# EAGLE design X-Light (EAGLE 6.4)
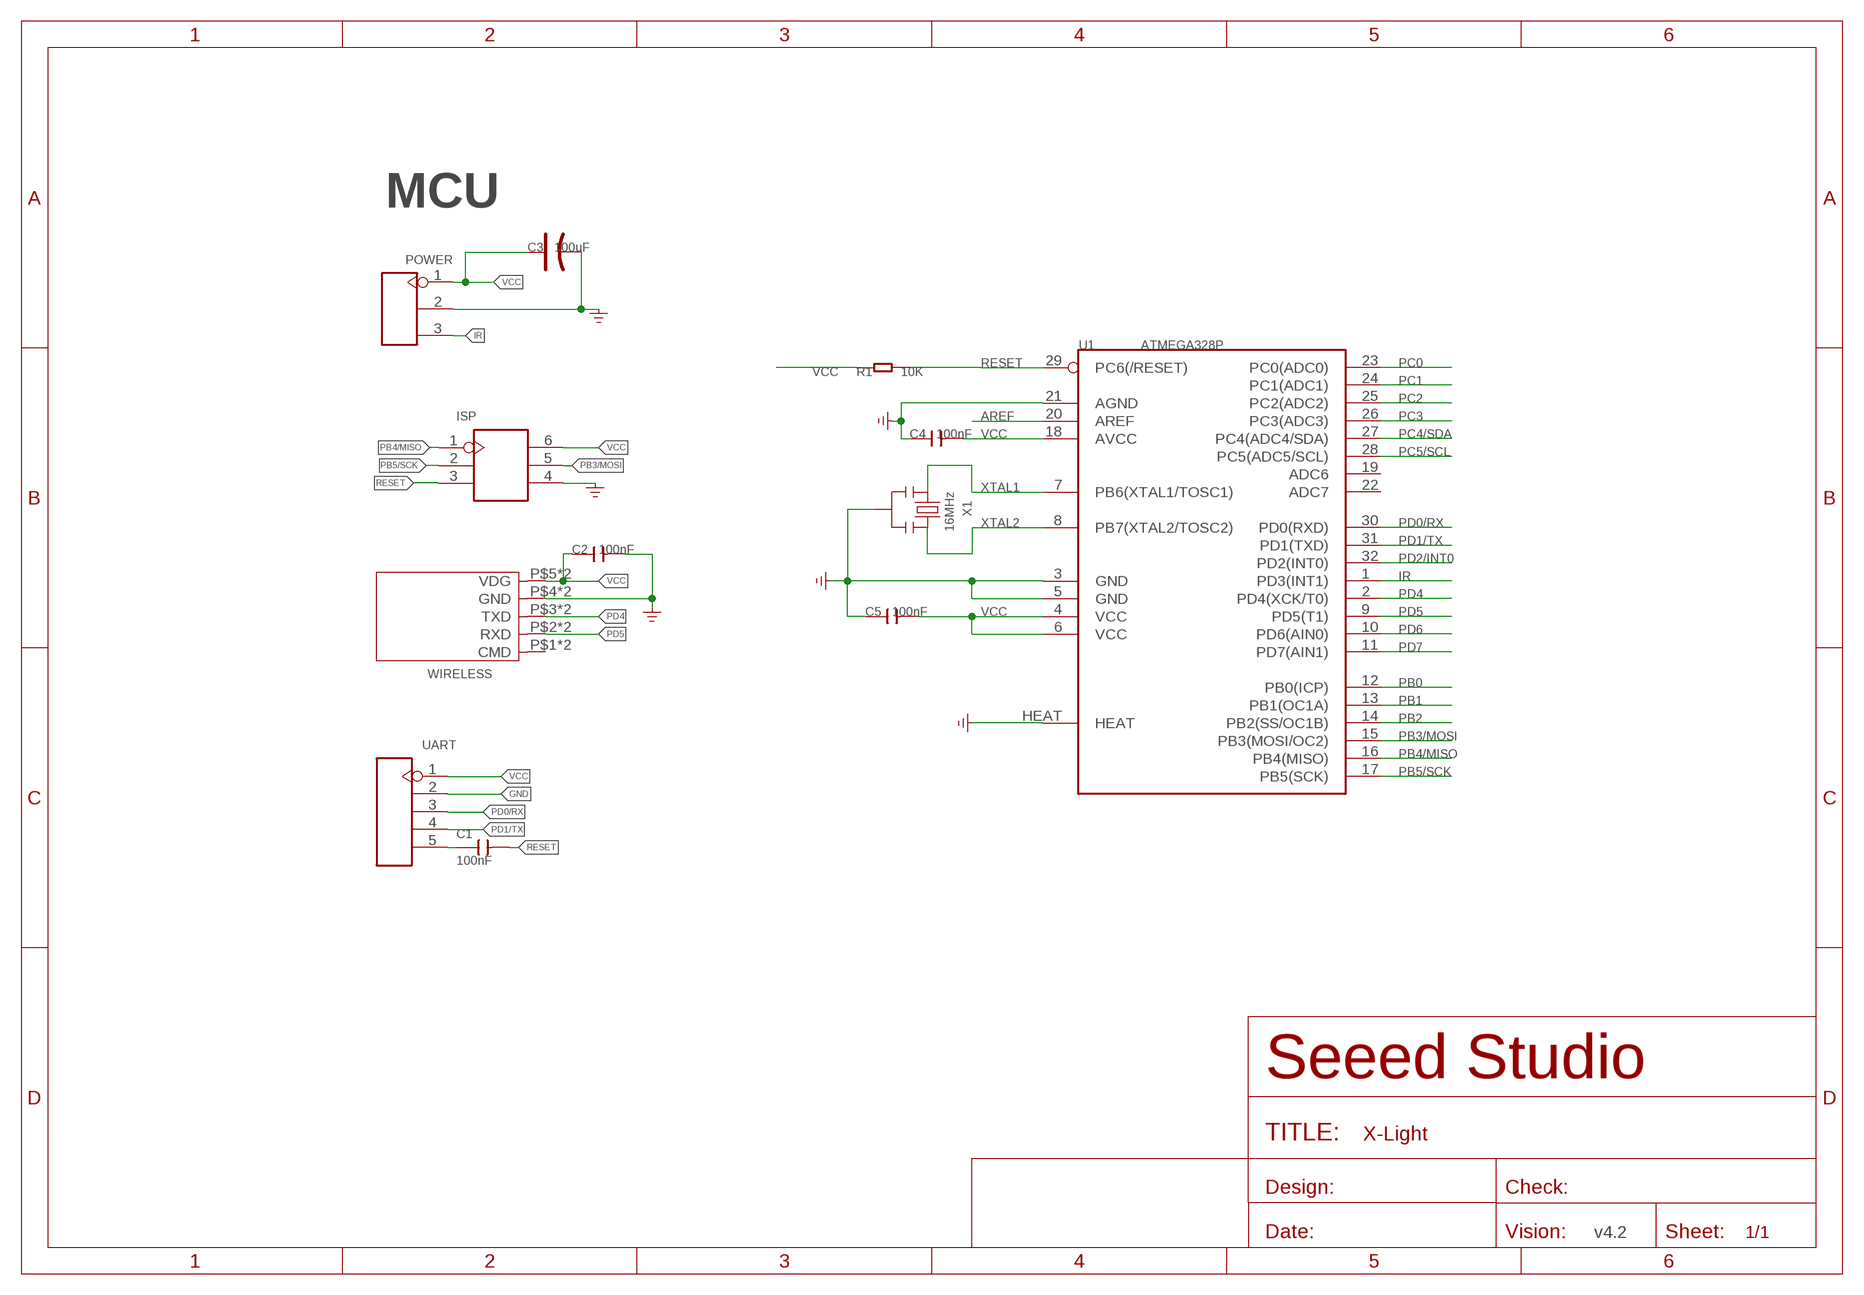
[diagram p0: schematic, sheet 1]

## Parts
C1  100nF  CAP-0603  [C0603]
C2  100nF  C-0603  [C0603]
C3  100uF  CAP-AVX-C  [AVX-C]
C4  100nF  C-0603  [C0603]
C5  100nF  C-0603  [C0603]
ISP  HEADER-2X3P-2.54  [H2X3-2.54]
POWER  HEADER-3P-2.54  [H3-2.54]
R1  10K  R-0603  [R0603]
U1  ATMEGA328P  MEGA8  [MLF32X]
UART  HEADER-5P-2.54  [H5-2.54]
WIRELESS  MOUDLE-5P  [5P-24.2X12.4MM-2.54]
X1  16MHz  CRYSTAL-RESONATOR'SMD'  [3P-SMD-3.6X1.3]

## Nets
AREF: U1.20(AREF)
GND: C2.2 C3.- C4.1 C5.1 ISP.4 POWER.2 U1.3(GND) U1.5(GND) U1.21(AGND) U1.HEAT UART.2 WIRELESS.P4(GND) WIRELESS.P$4(GND) X1.2 ; supply symbol labelled GND_POWER
IR: POWER.3 U1.1(PD3(INT1))
N$6: C1.1 UART.5
PB0: U1.12(PB0(ICP))
PB1: U1.13(PB1(OC1A))
PB2: U1.14(PB2(SS/OC1B))
PB3/MOSI: ISP.5 U1.15(PB3(MOSI/OC2))
PB4/MISO: ISP.1 U1.16(PB4(MISO))
PB5/SCK: ISP.2 U1.17(PB5(SCK))
PC0: U1.23(PC0(ADC0))
PC1: U1.24(PC1(ADC1))
PC2: U1.25(PC2(ADC2))
PC3: U1.26(PC3(ADC3))
PC4/SDA: U1.27(PC4(ADC4/SDA))
PC5/SCL: U1.28(PC5(ADC5/SCL))
PD0/RX: U1.30(PD0(RXD)) UART.3
PD1/TX: U1.31(PD1(TXD)) UART.4
PD2/INT0: U1.32(PD2(INT0))
PD4: U1.2(PD4(XCK/T0)) WIRELESS.P3(TXD) WIRELESS.P$3(TXD)
PD5: U1.9(PD5(T1)) WIRELESS.P2(RXD) WIRELESS.P$2(RXD)
PD6: U1.10(PD6(AIN0))
PD7: U1.11(PD7(AIN1))
RESET: C1.2 ISP.3 R1.2 U1.29(PC6(/RESET))
VCC: C2.1 C3.+ C4.2 C5.2 ISP.6 POWER.1 R1.1 U1.4(VCC) U1.6(VCC) U1.18(AVCC) UART.1 WIRELESS.P5(VDG) WIRELESS.P$5(VDG)
XTAL1: U1.7(PB6(XTAL1/TOSC1)) X1.1
XTAL2: U1.8(PB7(XTAL2/TOSC2)) X1.3
Unconnected: U1.19(ADC6) U1.22(ADC7) WIRELESS.P1(CMD) WIRELESS.P$1(CMD)

## Notes on the sheet
- MCU
- v4.2

## Library data of the parts
C1 = OPL-Capacitor:CAP: Ceramic Capacitors
C2 C4 C5 = Discrete:C*: Ceramic Capacitors
C3 = Discrete-smallsmall:CAP*: Electrolytic Capacitors,Tantalum Capacitors and Super Capacitors
ISP = Connector-new:HEADER-2X3P
POWER = Connector-new:HEADER-3P
R1 = Discrete:R*
U1 = ICs_v54:MEGA8
UART = Connector-new:HEADER-5P
WIRELESS = template:MOUDLE-5P
X1 = Discrete-smallsmall:CRYSTAL-RESONATOR: Resonator Small SMD resonator. This is the itty bitty 10/20MHz resonators with built in caps. CSTCE10M0G55 and CSTCE20M0V53. Footprint has been reviewed closely but hasn't been tested yet.

## Net classes
0 default: width 0.152 mm, clearance 0.152 mm
1 power: width 0.152 mm, drill 0.152 mm, clearance 0.152 mm
2 gnd: width 0.152 mm, drill 0.152 mm, clearance 0.152 mm
3 usbvcc: width 0.152 mm, drill 0.152 mm, clearance 0.152 mm

## Board
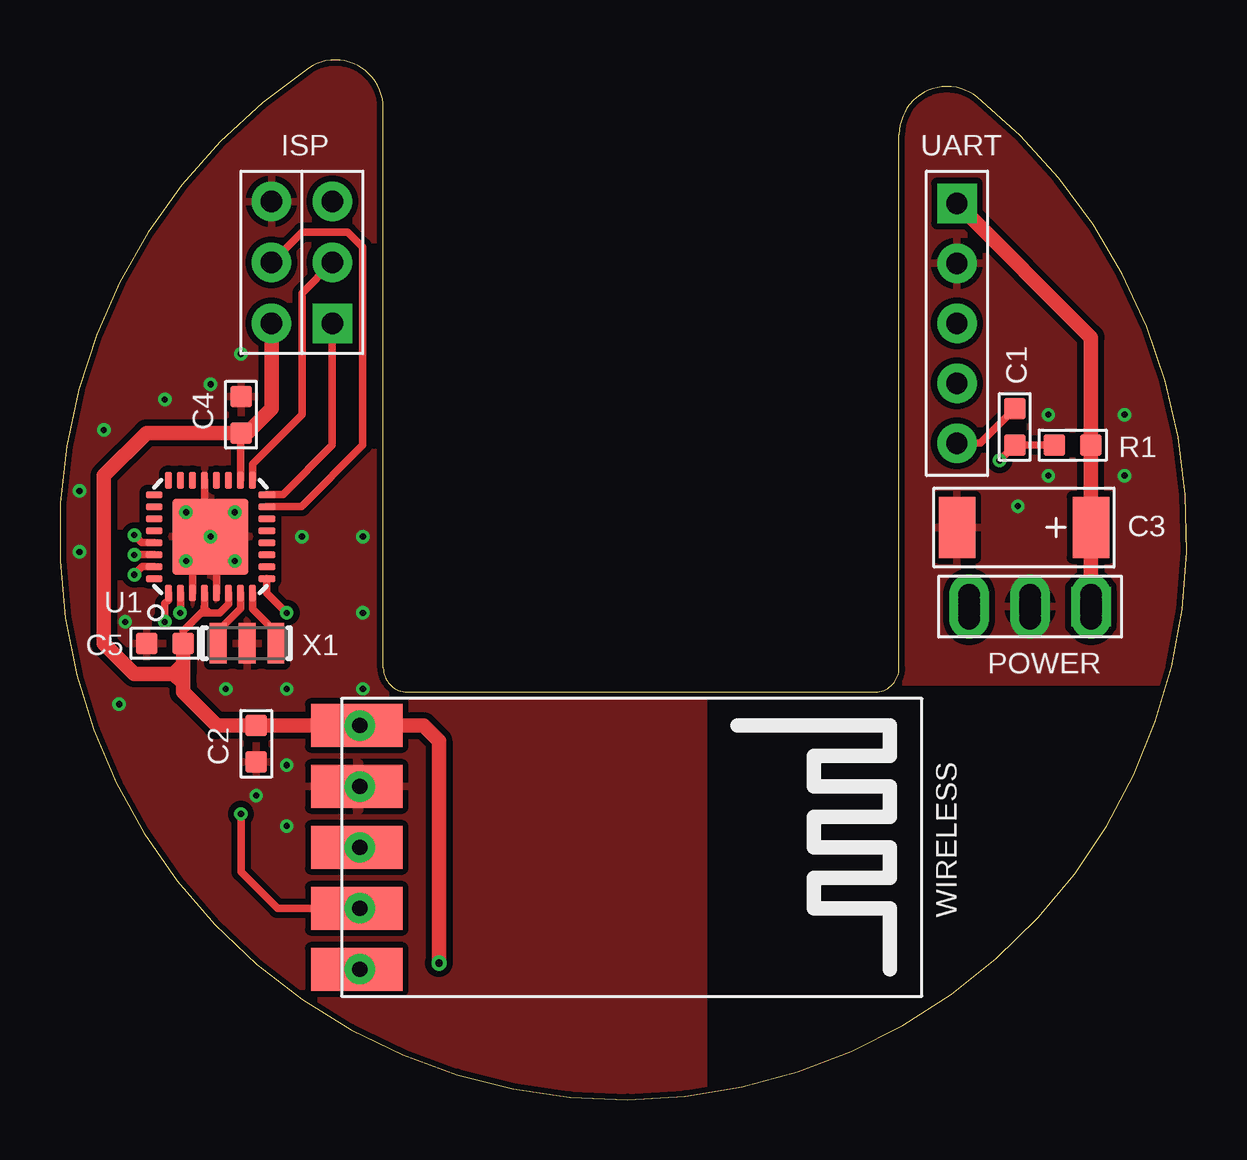
[diagram p1: board, top side]
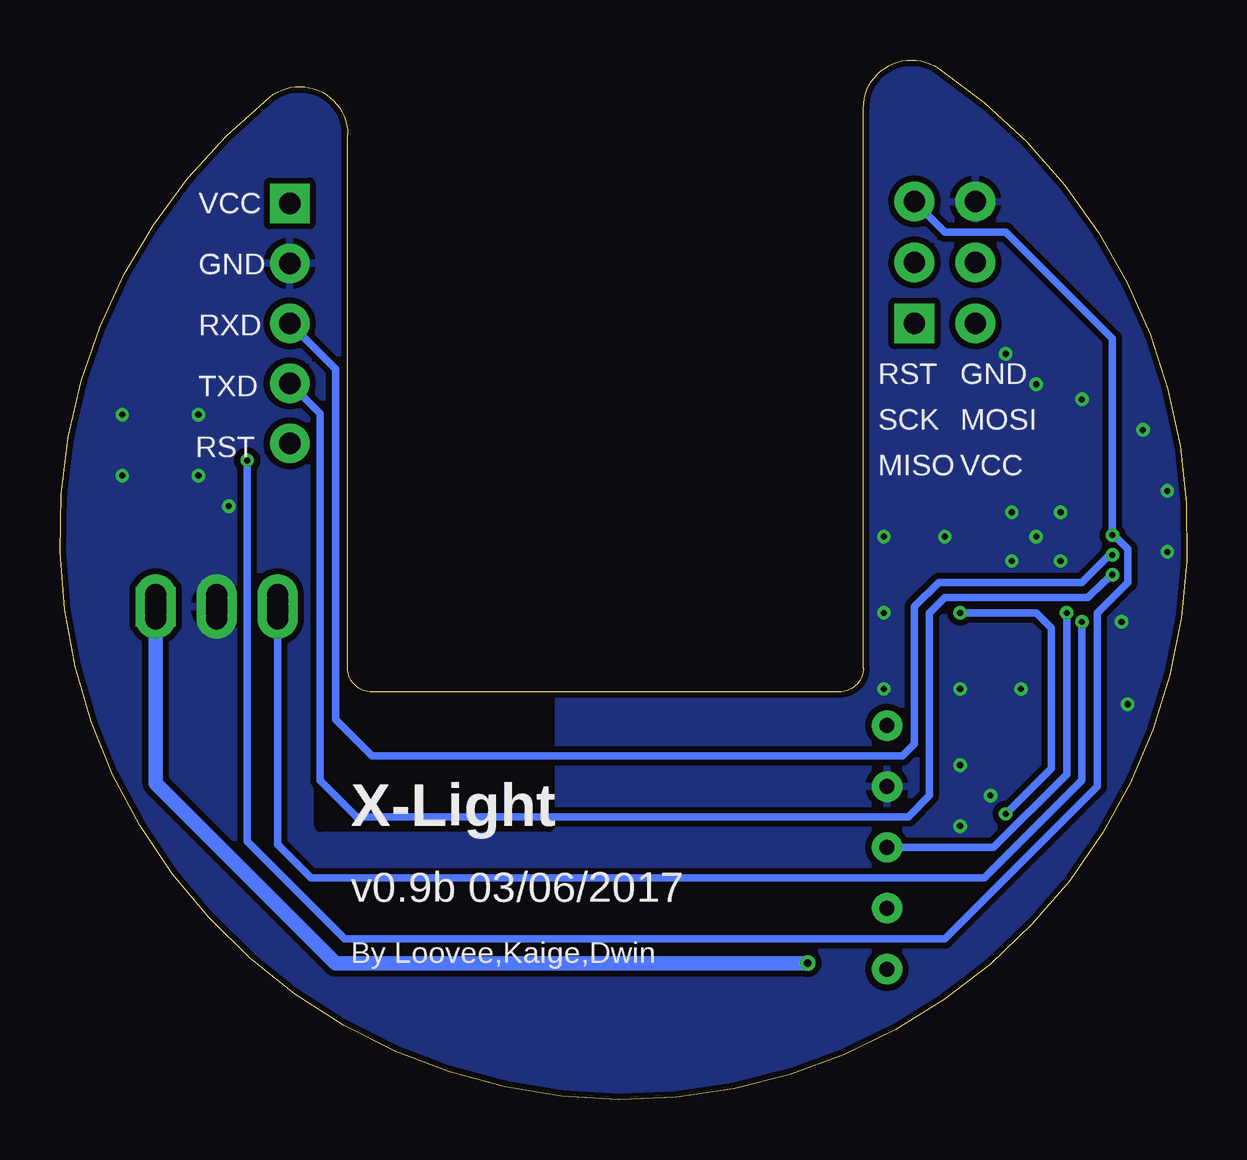
[diagram p2: board, bottom side, seen from below]

Size 46.97 x 43.34 mm. Coordinates in mm from the lower left corner, seen from the top.
Outline: 13.48,18 13.48,41.34 arc124 10.36,43 arc287 38.23,41.79 arc129 34.98,40.23 34.98,18 arc-90 33.98,17 14.48,17 arc-90 13.48,18
Copper layers (1*16): Top 0.035mm / dielectric 1.5mm / Bottom 0.035mm
Design rules "SeeedStudio_2layer_DRU_no_angle_20140221 *": minimum track width 6mil, minimum drill 10mil, track to track 6mil, track to pad 6mil, pad to pad 6mil, via to via 6mil, smd to smd 0mil, copper to edge 10mil, drill to drill 10mil, minimum pad ring 10mil, minimum via ring 6mil, stop-mask expansion 2mil, vias tented up to drill 25mil, thermal gap 10mil
tRestrict: area 27.2,0.4 to 47.5,17
bRestrict: area 26.6,11.4 to 36.1,17.1

### Footprints (pad centres in the part's own frame; a part is rotated, then mirrored left to right if it is on the bottom)
C0603 = smd 0.889 x 0.889: 1 0,0.762; 2 0,-0.762
C0603' = smd 0.889 x 0.889: 1 -0.762,0; 2 0.762,0
AVX-C = smd 1.524 x 2.54: + -2.794,0; - 2.794,0
H2X3-2.54 = drill 0.889 pad 1.651 square: 1 -1.27,2.54 | drill 0.889 pad 1.651: 2 -1.27,0; 3 -1.27,-2.54; 4 1.27,-2.54; 5 1.27,0; 6 1.27,2.54
H3-2.54 = drill 0.889 pad 1.651 square: 1 0,2.54 | drill 0.889 pad 1.651: 2 0,0; 3 0,-2.54
R0603 = smd 0.889 x 0.889: 1 -0.762,0; 2 0.762,0
MLF32X = smd 0.7 x 0.3: 1 -2.35,1.75; 2 -2.35,1.25; 3 -2.35,0.75; 4 -2.35,0.25; 5 -2.35,-0.25; 6 -2.35,-0.75; 7 -2.35,-1.25; 8 -2.35,-1.75; 17 2.35,-1.75; 18 2.35,-1.25; 19 2.35,-0.75; 20 2.35,-0.25; 21 2.35,0.25; 22 2.35,0.75; 23 2.35,1.25; 24 2.35,1.75 | smd 0.3 x 0.7: 9 -1.75,-2.35; 10 -1.25,-2.35; 11 -0.75,-2.35; 12 -0.25,-2.35; 13 0.25,-2.35; 14 0.75,-2.35; 15 1.25,-2.35; 16 1.75,-2.35; 25 1.75,2.35; 26 1.25,2.35; 27 0.75,2.35; 28 0.25,2.35; 29 -0.25,2.35; 30 -0.75,2.35; 31 -1.25,2.35; 32 -1.75,2.35 | smd 3.175 x 3.175: HEAT 0,0
H5-2.54 = drill 0.889 pad 1.651 square: 1 0,5 | drill 0.889 pad 1.651: 2 0,2.5; 3 0,0; 4 0,-2.5; 5 0,-5
5P-24.2X12.4MM-2.54 = drill 0.635 pad 1.27: P1 -0.762,5.08; P2 -0.762,2.54; P3 -0.762,0; P4 -0.762,-2.54; P5 -0.762,-5.08 | smd 3.81 x 1.778: P$1 -0.635,5.08; P$2 -0.635,2.54; P$3 -0.635,0; P$4 -0.635,-2.54; P$5 -0.635,-5.08
3P-SMD-3.6X1.3 = smd 0.7 x 1.7: 1 -1.2,0; 2 0,0; 3 1.2,0

### Placement (x,y rotation side)
C1  39.8,28.04 0 top
C2  100nF  [C0603']  8.18,14.83 270 top
C3  40.18,23.85 180 top
C4  100nF  [C0603']  7.54,28.55 270 top
C5  100nF  [C0603']  4.37,19.02 0 top
ISP  10.08,34.9 180 top
POWER  40.44,20.55 270 top
R1  42.21,27.28 180 top
U1  6.27,23.47 90 top
UART  37.39,32.36 0 top
WIRELESS  11.73,10.52 180 top
X1  7.8,19.02 0 top

### Tracks (layer width: path | path; a pad name or v marks a point on that pad's centre or on a via)
GND  (via drill 0.25 pad 0.51, 0.89 pad 1.65)
  Top 0.305: U1.5 6.52,23.22 U1.HEAT | U1.3 5.52,22.19 v5.26,22.45 | U1.21 6.02,24.49 v5.26,24.49
  other vias: 9.45,13.94 8.18,12.67 9.45,11.4 6.91,17.12 9.45,17.12 6.27,23.47 7.29,22.45 7.29,24.49 2.72,19.91 6.27,29.82 7.54,31.09 4.37,29.18 1.83,27.91 0.81,22.83 0.81,25.37 2.46,16.48 10.08,23.47 12.62,23.47 12.62,20.29 12.62,17.12 41.2,26.01 41.2,28.55 44.37,28.55 44.37,26.01 39.93,24.74 40.44,20.68 40.44,20.8 40.44,21.06 40.44,20.42 40.44,20.29 40.44,20.04
  pour Bottom (isolate 0.254): -0.71,-0.79 48.18,-0.79 48.18,43.79 -0.71,43.79
  pour Top (isolate 0.254): -0.71,-0.79 48.18,-0.79 48.18,43.79 -0.71,43.79
IR  (via drill 0.25 pad 0.51, 0.89 pad 1.65)
  Top 0.305: U1.1 4.52,20.83 4.37,20.68 v4.37,19.91
  Bottom 0.152: v37.9,21.06 v37.9,20.8 POWER.3
  Bottom 0.305: POWER.3 v37.9,20.42 v37.9,20.29 v37.9,20.04 37.9,10.64 36.5,9.25 8.43,9.25 4.37,13.31 v4.37,19.91
N$6
  Top 0.305: UART.5 37.75,27.36 38.23,27.36 38.36,27.36 C1.1
PB3/MOSI
  Top 0.305: U1.15 10.06,24.72 12.62,27.28 12.62,35.53 11.99,36.17 10.08,36.17 ISP.5
PB4/MISO
  Top 0.305: U1.16 9.29,25.22 11.35,27.28 ISP.1
PB5/SCK
  Top 0.305: U1.17 8.02,26.49 10.08,28.55 10.08,33.63 ISP.2
PD0/RX  (via drill 0.25 pad 0.51)
  Top 0.305: U1.30 3.11,22.72 v3.1,22.71
  Bottom 0.305: UART.3 35.48,30.45 35.48,15.85 33.96,14.33 11.86,14.33 11.35,14.83 11.35,20.55 10.34,21.56 4.37,21.56 3.23,22.71 v3.1,22.71
PD1/TX  (via drill 0.25 pad 0.51)
  Top 0.305: U1.31 3.44,22.22 v3.1,21.88
  Bottom 0.305: UART.4 36.12,28.59 36.12,13.31 34.59,11.79 11.61,11.79 10.72,12.67 10.72,20.29 10.08,20.93 4.11,20.93 3.48,21.56 v3.1,21.88
PD4  (via drill 0.25 pad 0.51)
  Top 0.305: WIRELESS.P$3 WIRELESS.P3 | U1.2 5.02,20.38 v5,20.29
  Bottom 0.305: WIRELESS.P3 8.05,10.52 5,13.56 v5,20.29
PD5  (via drill 0.25 pad 0.51)
  Top 0.305: U1.9 8.62,21.12 v9.45,20.29 | v7.54,11.91 7.54,9.5 9.07,7.98 WIRELESS.P$2 WIRELESS.P2
  Bottom 0.305: v9.45,20.29 6.27,20.29 5.64,19.66 5.64,13.82 v7.54,11.91
RESET  (via drill 0.25 pad 0.51)
  Top 0.305: R1.2 C1.2 v39.17,26.64 | U1.29 3.41,23.22 v3.1,23.53
  Bottom 0.305: ISP.3 10.08,36.17 7.54,36.17 3.1,31.72 v3.1,23.53 3.03,23.53 2.46,22.96 2.46,21.56 3.73,20.29 3.73,13.06 10.08,6.71 35.1,6.71 39.17,10.77 v39.17,26.64
VCC  (via drill 0.3 pad 0.64, 0.89 pad 1.65)
  Top 0.305: C5.2 5.13,19.53 5.89,20.29 | U1.4 6.02,20.55 6.02,20.48 | U1.18 7.52,27.77 C4.2 | U1.6 7.02,20.66 6.65,20.29 6.21,20.29 | 6.21,20.29 6.02,20.29 | 6.02,20.48 6.02,20.42 | 6.02,20.42 6.02,20.29 | 6.02,20.48 6.21,20.29 | 6.02,20.29 5.89,20.29 | 5.89,20.29 6.02,20.42
  Top 0.61: UART.1 42.98,31.77 R1.1 POWER.1 C3.+ | WIRELESS.P$5 C2.1 6.53,15.6 5.13,16.99 5.13,17.37 | C5.2 5.13,18.14 | 5.13,18.14 5.13,17.75 | ISP.6 8.81,28.8 7.78,27.77 7.52,27.77 | 6.27,27.79 C4.2 3.61,27.79 1.83,26.01 1.83,19.02 3.1,17.75 4.75,17.75 | 5.13,17.75 4.75,17.75 | WIRELESS.P$5 WIRELESS.P5 | WIRELESS.P$5 15.16,15.6 15.8,14.96 v15.8,5.69 | 4.75,17.75 5.13,18.14 | 4.75,17.75 5.13,17.37 | 5.13,17.37 5.13,17.75
  Bottom 0.305: v42.98,21.06 v42.98,20.8 v42.98,20.68 v42.98,20.29
  Bottom 0.61: POWER.1 v42.98,20.42 v42.98,20.29 v42.98,20.04 42.98,13.18 35.48,5.69 v15.8,5.69
XTAL1
  Top 0.305: U1.7 7.52,20.46 6.72,19.66 6.65,19.66 6.65,19.08 X1.1
XTAL2
  Top 0.305: U1.8 8.02,20.45 8.94,19.53 8.94,19.08 X1.3

### Text on the board
bPlace: VCC | GND | RXD | GND | RST | TXD | MOSI | SCK | VCC | MISO | RST | X-Light | v0.9b 03/06/2017 | By Loovee,Kaige,Dwin